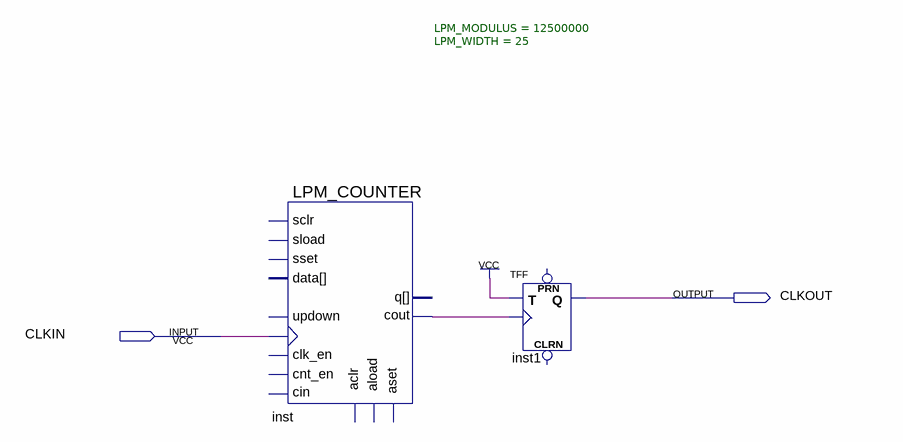
[diagram p0: schematic sheet]
// Quartus schematic divisor_de_clock.bdf as structural Verilog: 2 symbols, 2 pins
module divisor_de_clock (
  input  CLKIN,
  output CLKOUT
);

  wire inst_cout;

  LPM_COUNTER #(.LPM_MODULUS(12500000), .LPM_WIDTH(25)) inst (
    .clock(CLKIN), .cout(inst_cout));  // open: sload, data, clk_en, aload, aclr, aset, cin, sset, updown, cnt_en, sclr, q
  TFF inst1 (.T(1'b1), .CLK(inst_cout), .Q(CLKOUT));  // open: PRN, CLRN
endmodule
